# EasyEDA schematic SCH_Drone_lap_Timer_2024-11-07.json
TITLE: Sheet_1; REV: 1.0; Date: 2024-11-06; Sheet: 1/1; Drawn By: rickjr; Company: Your Company
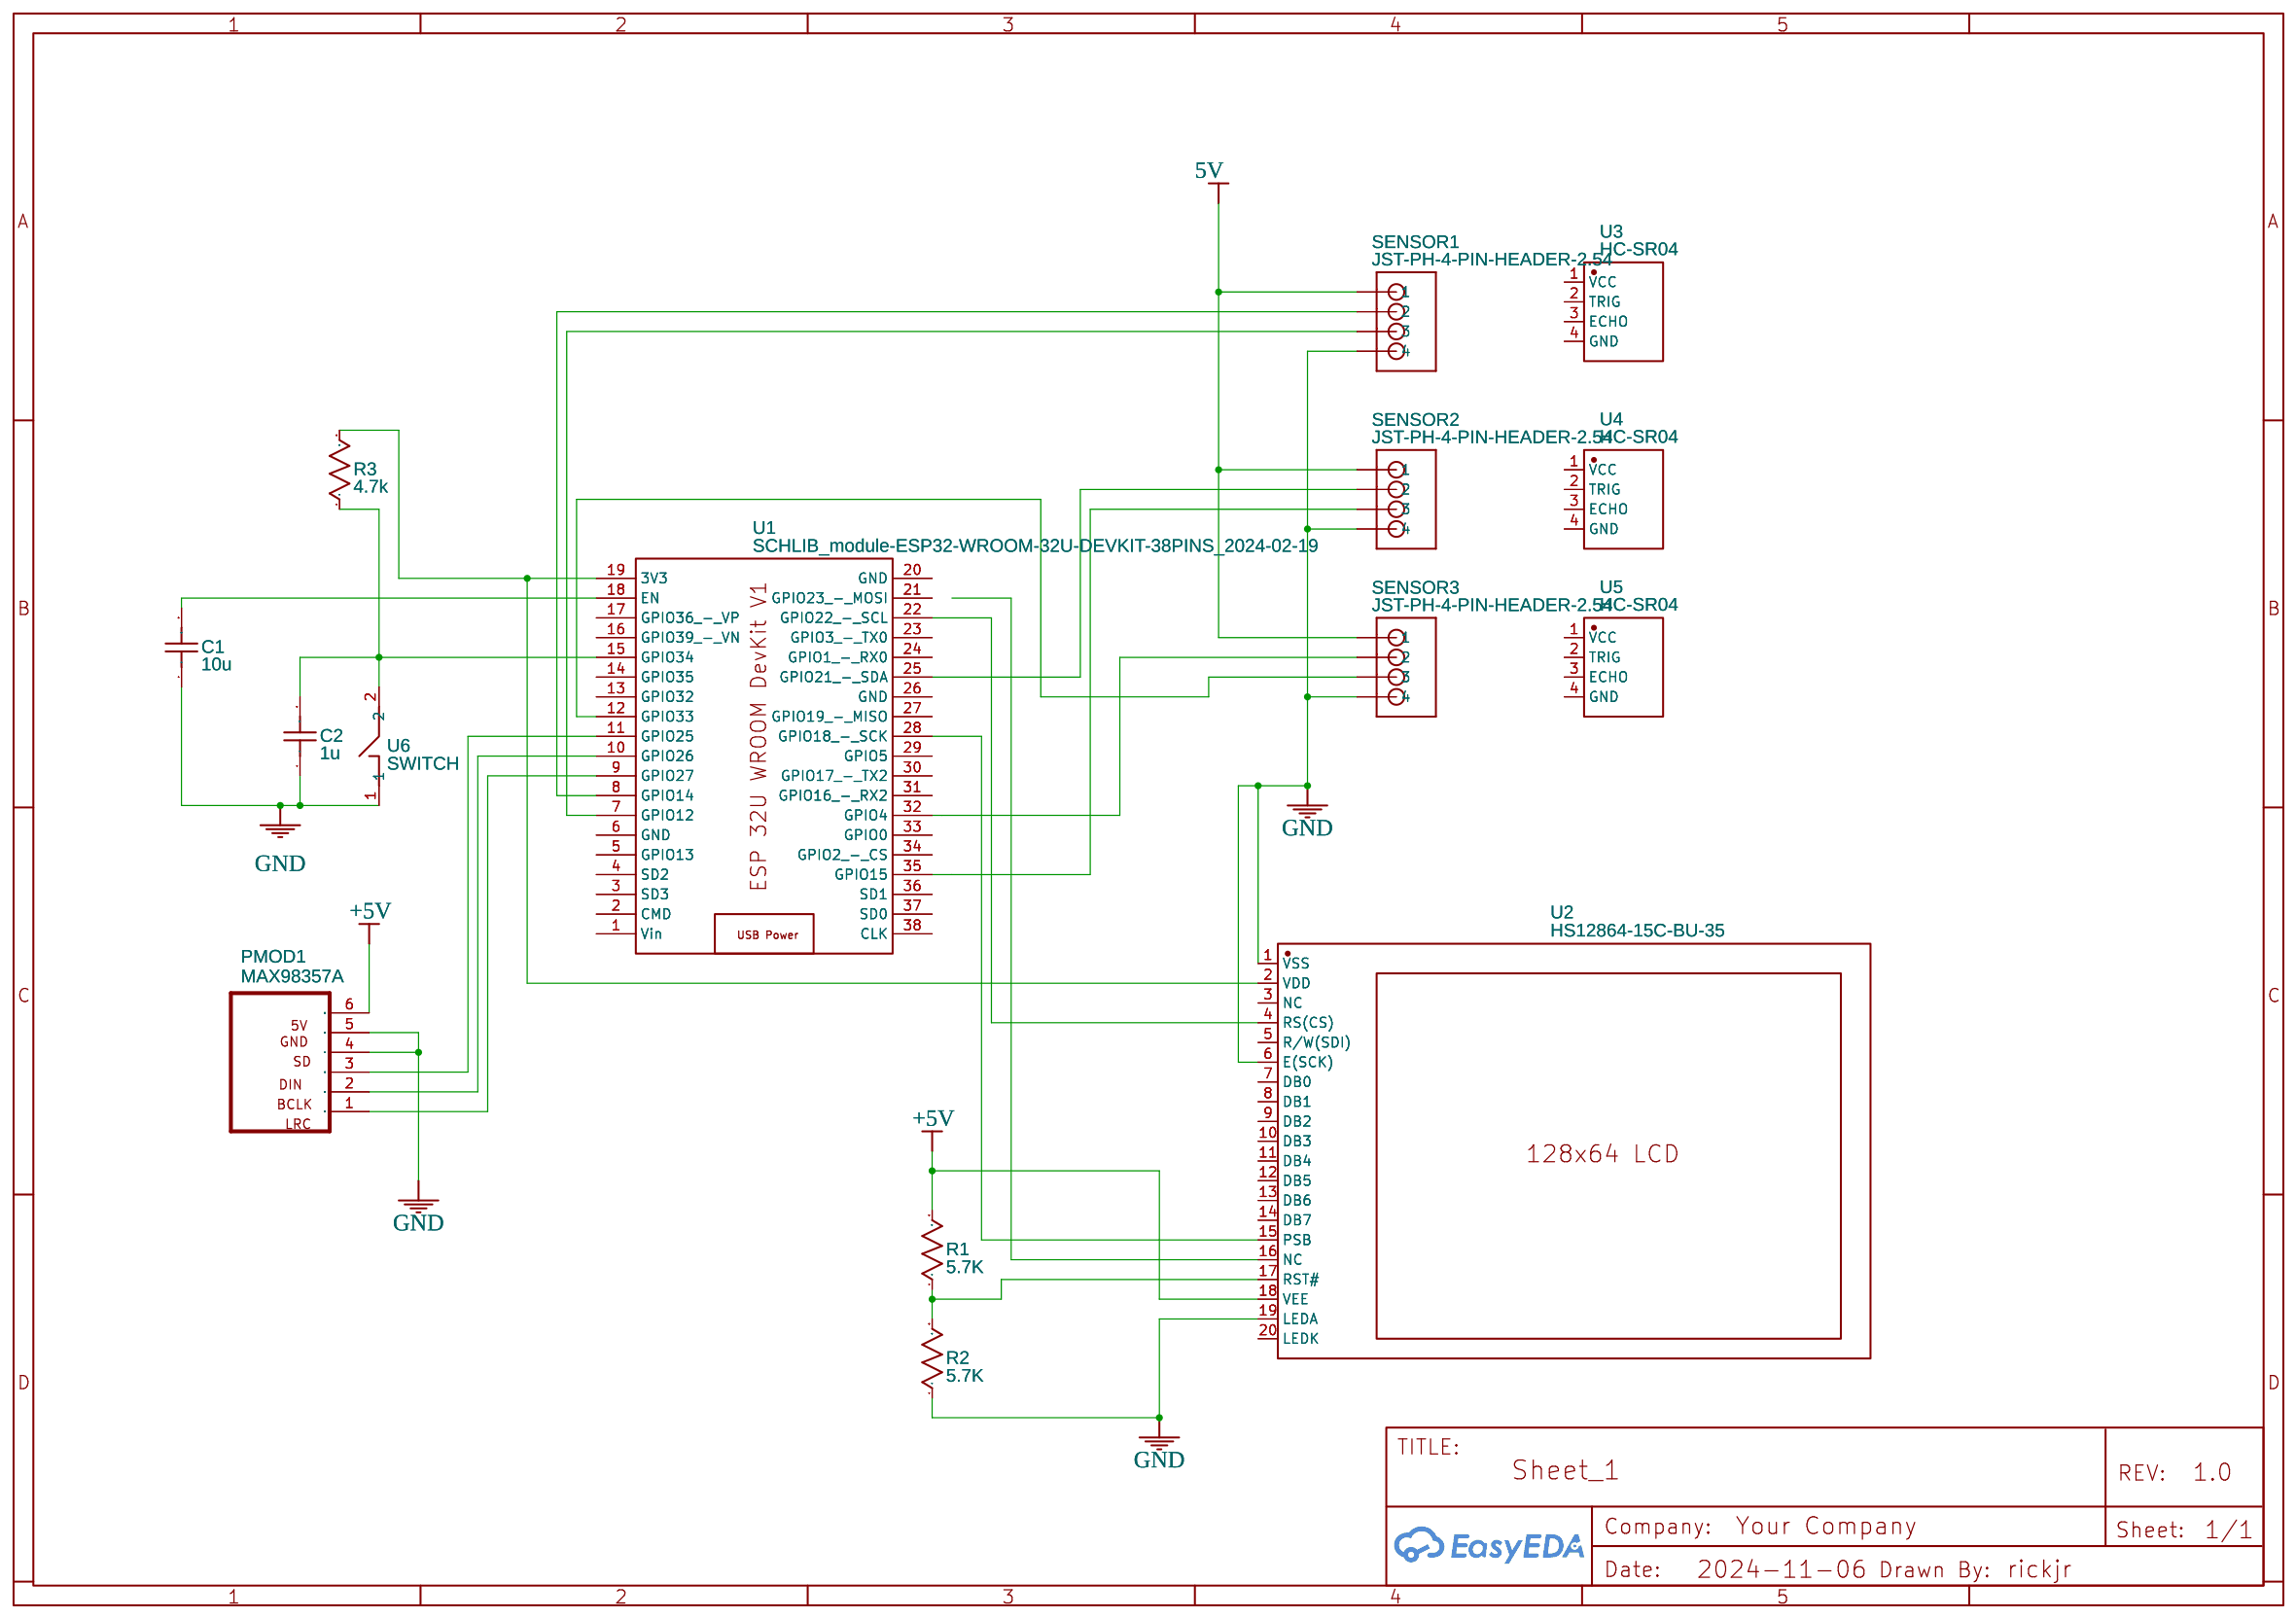
[diagram p0: schematic sheet]

## Parts
C1  10u  [RAD-0.1]
C2  1u  [RAD-0.1]
PMOD1  MAX98357A  [PA_PMOD_SIL_FEMALE]
R1  5.7K  [R_AXIAL-0.5]
R2  5.7K  [R_AXIAL-0.5]
R3  4.7k  [R_AXIAL-0.5]
SENSOR1  JST-PH-4-PIN-HEADER-2.54  [JST-PH-4PIN-2.54]
SENSOR2  JST-PH-4-PIN-HEADER-2.54  [JST-PH-4PIN-2.54]
SENSOR3  JST-PH-4-PIN-HEADER-2.54  [JST-PH-4PIN-2.54]
U1  SCHLIB_module-ESP32-WROOM-32U-DEVKIT-38PINS_2024-02-19  [ESP32-DEVKITC CORE BOARD ESP32]
U2  HS12864-15C-BU-35  [LCD-TH_NHD-12864AZ-NSW-BBW-TR]
U3  HC-SR04  [TH_HC-SR04V]
U4  HC-SR04  [TH_HC-SR04V]
U5  HC-SR04  [TH_HC-SR04V]
U6  SWITCH  [SW-SMD_L11.5-W2.3-LS15.5]

## Library data of the parts
C1 C2 = C_RAD-0.1_US: Contributor: LCEDA_Lib
PMOD1 = PA_PMOD_I2S_SIL_HOST: PatternAgents Peripheral Module I2S Audio (Type 7) Pattern; Contributor: PatternAgents
R1-R3 = R_AXIAL-0.5_US: Contributor: LCEDA_Lib
SENSOR1-SENSOR3 = JST-PH-4-PIN-HEADER-2.54: Contributor: hs3uka
U1 = SCHLIB_module-ESP32-WROOM-32U-DEVKIT-38PINS_2024-02-19: Supplier: Sparkfun; Contributor: BentJul
U2 = HS12864-15C-BU-35: Supplier: LCSC; Supplier Part: C7471188; Manufacturer: HS(汉昇); Contributor: lcsc
U3-U5 = HC-SR04: Supplier: LCSC; Supplier Part: C19857336; Manufacturer: Universal Microelectronics; Contributor: lcsc; JLCPCB Part Class: Extended Part
U6 = SWITCH: Contributor: lcsc; Supplier: LCSC; Supplier Part: C9900011059; Manufacturer: null; JLCPCB Part Class: Extended Part

## Nets
5V: SENSOR1.1 SENSOR2.1 SENSOR3.1
+5V: PMOD1.6 R1.2 U2.18(VEE)
GND: C1.1 C2.1 PMOD1.4 PMOD1.5 R2.1 SENSOR1.4 SENSOR2.4 SENSOR3.4 U2.1(VSS) U2.6(E(SCK)) U2.19(LEDA) U6.1
Net-(C1-2): C1.2 U1.18(EN)
Net-(C2-2): C2.2 R3.1 U1.15(GPIO34) U6.2
Net-(PMOD1-1): PMOD1.1 U1.9(GPIO27)
Net-(PMOD1-2): PMOD1.2 U1.10(GPIO26)
Net-(PMOD1-3): PMOD1.3 U1.11(GPIO25)
Net-(R1-1): R1.1 R2.2 U2.17(RST#)
Net-(R3-2): R3.2 U1.19(3V3) U2.2(VDD)
Net-(SENSOR1-2): SENSOR1.2 U1.8(GPIO14)
Net-(SENSOR1-3): SENSOR1.3 U1.7(GPIO12)
Net-(SENSOR2-2): SENSOR2.2 U1.25(GPIO21 - SDA)
Net-(SENSOR2-3): SENSOR2.3 U1.35(GPIO15)
Net-(SENSOR3-2): SENSOR3.2 U1.32(GPIO4)
Net-(SENSOR3-3): SENSOR3.3 U1.12(GPIO33)
Net-(U1-22): U1.22(GPIO22 - SCL) U2.4(RS(CS))
Net-(U1-28): U1.28(GPIO18 - SCK) U2.15(PSB)

Not connected (* = marked no-connect by the designer): U1 1(Vin) 2(CMD) 3(SD3) 4(SD2) 5(GPIO13) 6(GND) 13(GPIO32) 14(GPIO35) 16(GPIO39 - VN) 17(GPIO36 - VP) 20(GND) 21(GPIO23 - MOSI) 23(GPIO3 - TX0) 24(GPIO1 - RX0) 26(GND) 27(GPIO19 - MISO) 29(GPIO5) 30(GPIO17 - TX2) 31(GPIO16 - RX2) 33(GPIO0) 34(GPIO2 - CS) 36(SD1) 37(SD0) 38(CLK); U2 3(NC) 5(R/W(SDI)) 7(DB0) 8(DB1) 9(DB2) 10(DB3) 11(DB4) 12(DB5) 13(DB6) 14(DB7) 16(NC) 20(LEDK); U3 1(VCC) 2(TRIG) 3(ECHO) 4(GND); U4 1(VCC) 2(TRIG) 3(ECHO) 4(GND); U5 1(VCC) 2(TRIG) 3(ECHO) 4(GND)
